# EasyEDA schematic TRS-80 Testboard.json
TITLE: Testboard; REV: 1.0; Date: 2022-04-18; Sheet: 1/1; Drawn By: dannybloe; Company: Your Company
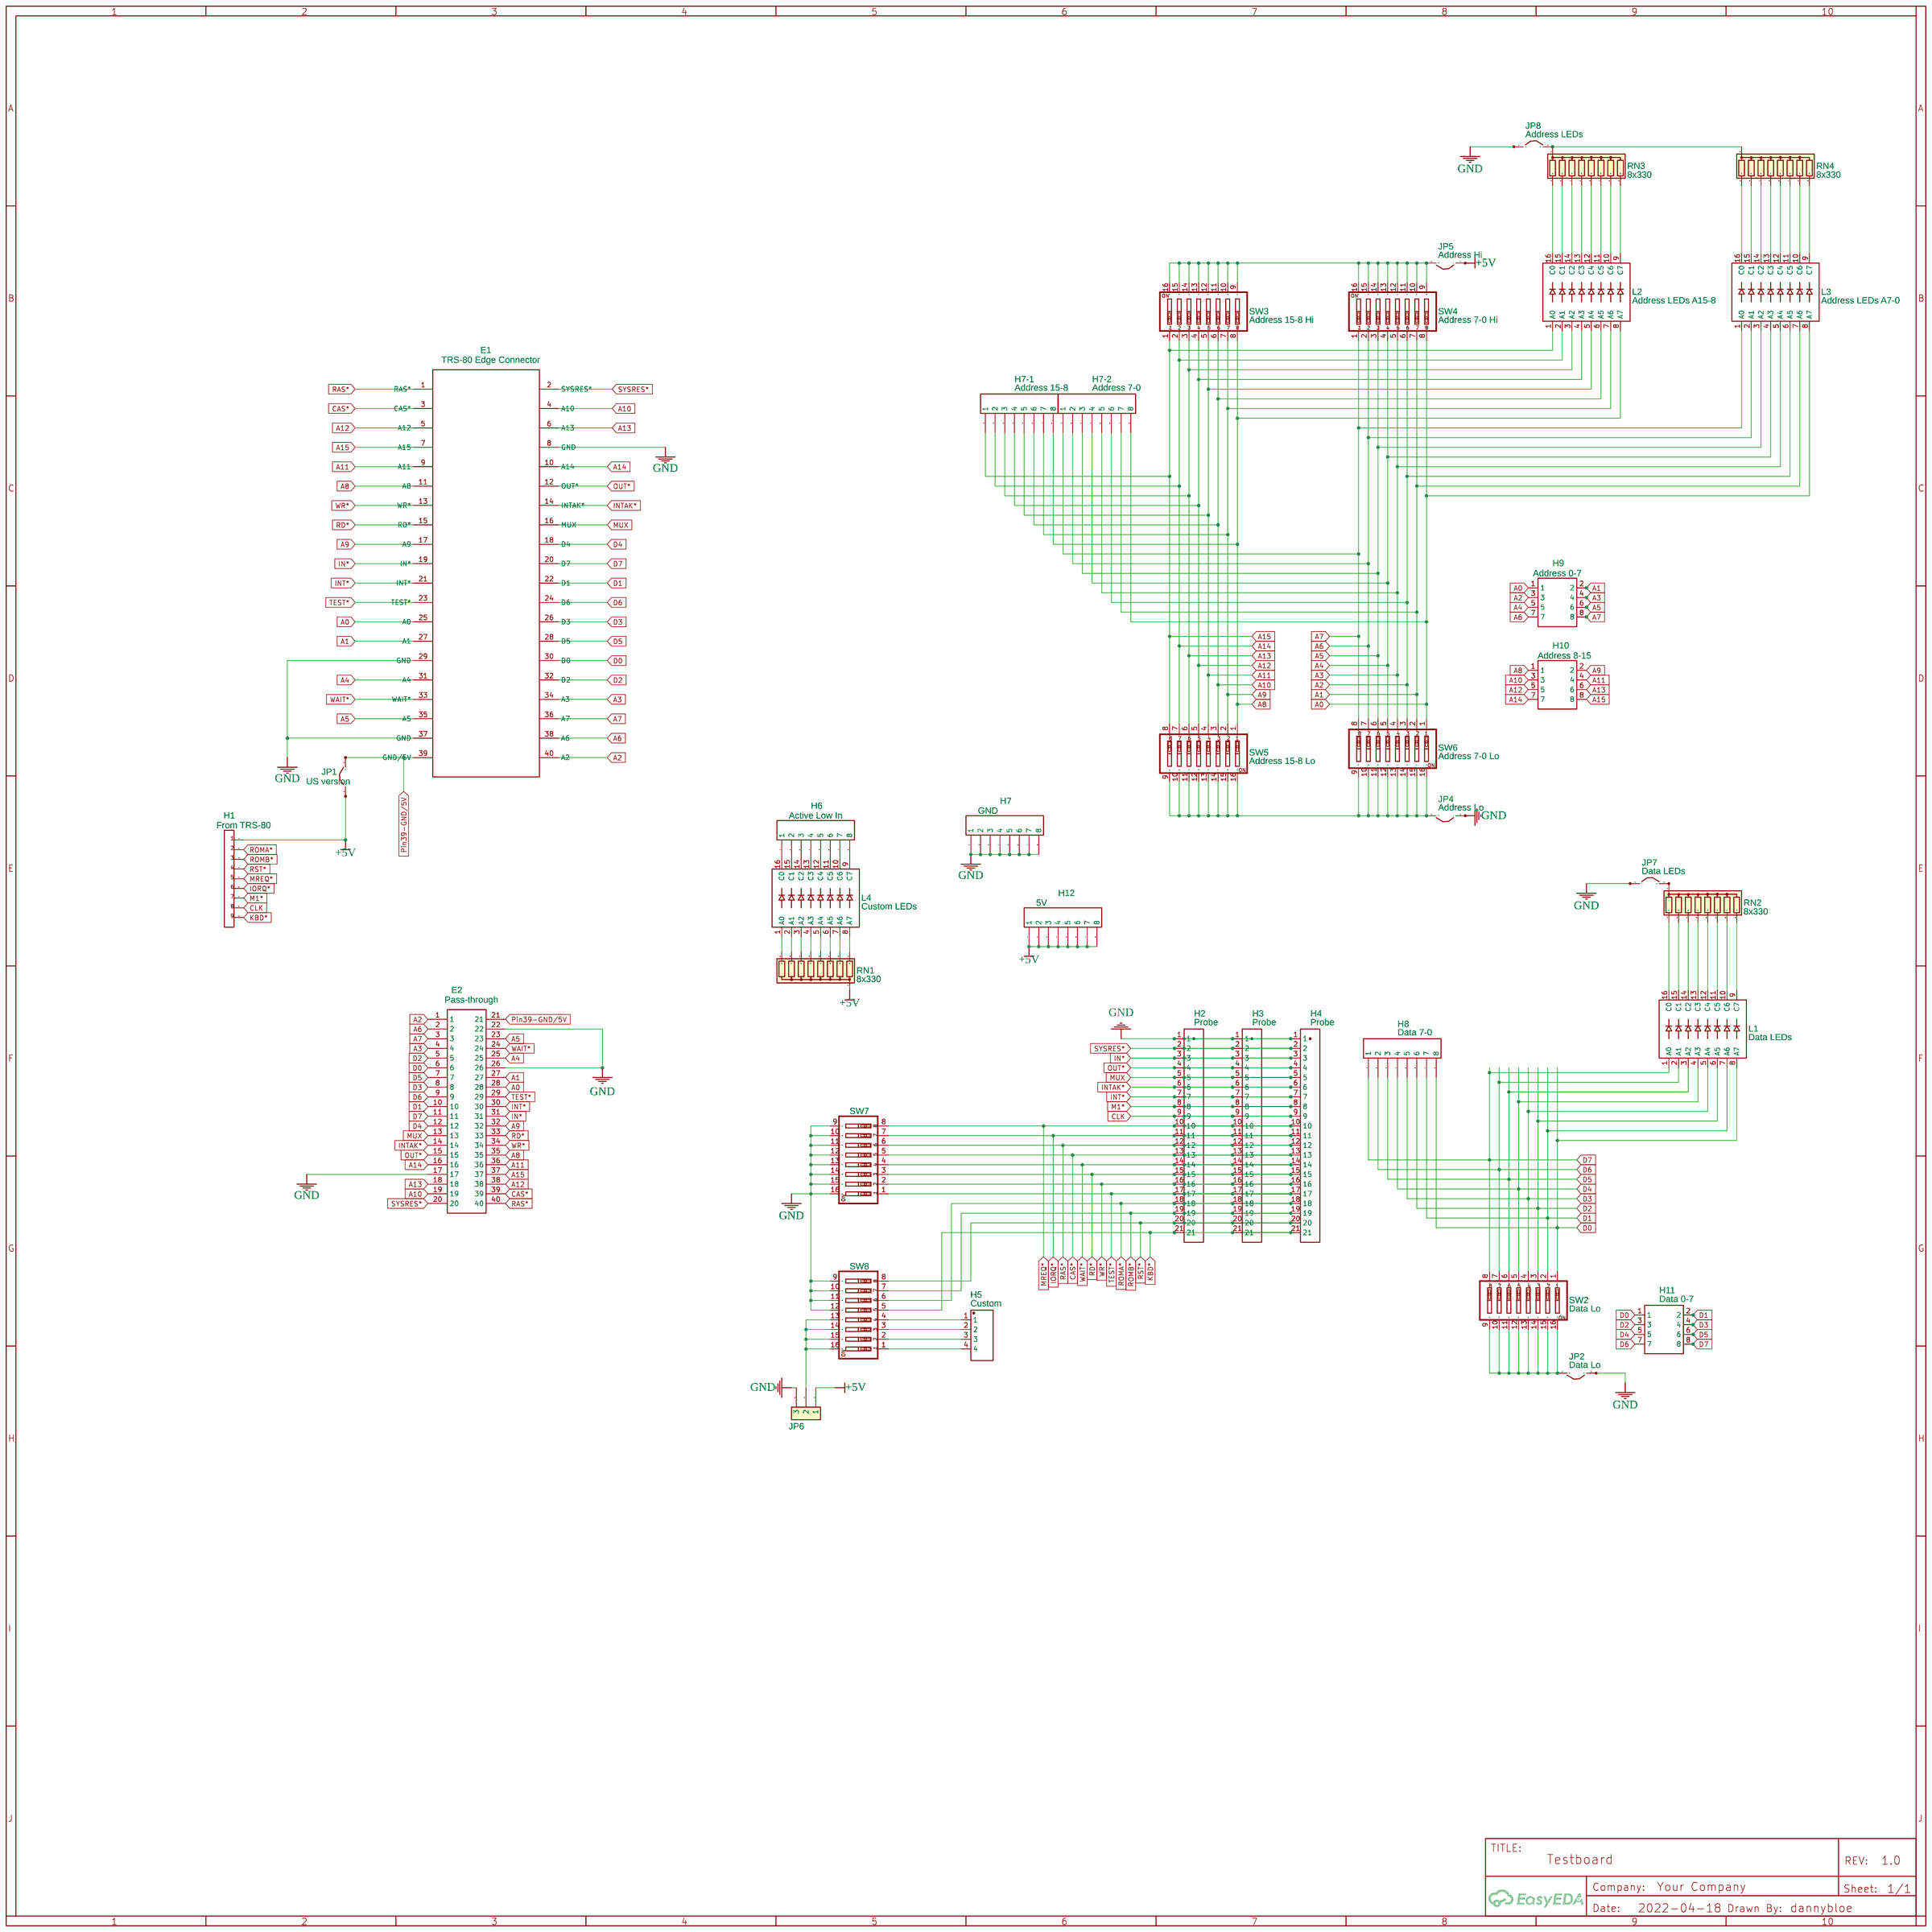
[diagram p0: schematic sheet]

## Parts
E1  TRS-80 Edge Connector  [TRS-80 EDGE CONNECTOR FOOTPRINT]
E2  Pass-through  [40-POS EDGE CONNECTOR]
H1  From TRS-80  [HEADER1X9_2.54]
H2  Probe  [21P]
H3  Probe  [21P]
H4  Probe  [21P]
H5  Custom  [HEADER - HEADER-FEMALE-2.54_1X4]
H6  Active Low In  [HDR-TH_8PIN-V-MALE-PITCH2.54]
H7  GND  [HDR-TH_8PIN-V-MALE-PITCH2.54]
H7-1  Address 15-8  [HDR-TH_8PIN-V-MALE-PITCH2.54]
H7-2  Address 7-0  [HDR-TH_8PIN-V-MALE-PITCH2.54]
H8  Data 7-0  [HDR-TH_8PIN-V-MALE-PITCH2.54]
H9  Address 0-7  [BOX HEADER 8P]
H10  Address 8-15  [BOX HEADER 8P]
H11  Data 0-7  [BOX HEADER 8P]
H12  5V  [HDR-TH_8PIN-V-MALE-PITCH2.54]
JP1  US version  [HDR-TH_2P-P2.54-V-M-1]
JP2  Data Lo  [HDR-TH_2P-P2.54-V-M-1]
JP4  Address Lo  [HDR-TH_2P-P2.54-V-M-1]
JP5  Address Hi  [HDR-TH_2P-P2.54-V-M-1]
JP6  Header1x3  [HEADER1X3]
JP7  Data LEDs  [HDR-TH_2P-P2.54-V-M-1]
JP8  Address LEDs  [HDR-TH_2P-P2.54-V-M-1]
L1  Data LEDs  [BARGRAPH_8]
L2  Address LEDs A15-8  [BARGRAPH_8]
L3  Address LEDs A7-0  [BARGRAPH_8]
L4  Custom LEDs  [BARGRAPH_8]
RN1  8x330  [RESISTORNETWORK_8]
RN2  8x330  [RESISTORNETWORK_8]
RN3  8x330  [RESISTORNETWORK_8]
RN4  8x330  [RESISTORNETWORK_8]
SW2  Data Lo  [DIPSWITCH-08]
SW3  Address 15-8 Hi  [DIPSWITCH-08]
SW4  Address 7-0 Hi  [DIPSWITCH-08]
SW5  Address 15-8 Lo  [DIPSWITCH-08]
SW6  Address 7-0 Lo  [DIPSWITCH-08]
SW7  Switches  [DIPSWITCH-08]
SW8  Switches  [DIPSWITCH-08]

## Library data of the parts
E1 = TRS-80 Edge Connector: Contributor: Guest
E2 = 40-pos Edge Connector: Contributor: jowbiwan
H1 = Header1x9_2.54: Contributor: yabb777
H2-H4 = Header 21pin: Contributor: dannybloe
H5 = HEADER - HEADER-FEMALE-2.54_1X4: Contributor: chrisrisse; Supplier: Sparkfun
H6 H7 H7-1 H7-2 H8 H12 = Header2.54mm 1*8P: Supplier Part: C49256; Supplier: LCSC; Manufacturer: ReliaPro; image: http://image.lceda.cn/szlcsc/C49256.jpg; Contributor: ishtiaq1ahmed
H9-H11 = Box Header 8P: Manufacturer Part: BKL 10120552; Contributor: woodencup
JP1 JP2 JP4 JP5 JP7 JP8 = JUMPERTHRUHOLE: Supplier Part: NONE; Manufacturer: NONE; Manufacturer Part: NONE; Contributor: RaspAutomacao
JP6 = Header1x3: Supplier Part: C35445; Supplier: LCSC; Manufacturer: LCSC; Manufacturer Part: Header-Female-2.54_1x10; Contributor: Createyourpersonalaccount
L1-L4 = BARGRAPH_8: Contributor: Serotonindude
RN1-RN4 = Resistor Network 8: Contributor: Serotonindude; license: https://www.gnu.org/licenses/lgpl-2.1.html
SW2-SW8 = SW_DIP-8: Contributor: Umair Khan

## Nets
+5V: H1.1 H12.1 H12.2 H12.3 H12.4 H12.5 H12.6 H12.7 H12.8 JP1.1 JP5.1 JP6.1 RN1.1(common)
GND: E1.8(GND) E1.29(GND) E1.37(GND) E2.17 E2.22 E2.26 H2.1 H3.1 H4.1 H7.1 H7.2 H7.3 H7.4 H7.5 H7.6 H7.7 H7.8 JP2.1 JP4.1 JP6.3 JP7.1 JP8.1 SW7.9 SW7.10 SW7.11 SW7.12 SW7.13 SW7.14 SW7.15 SW7.16 SW8.9 SW8.10 SW8.11 SW8.12
Pin39-GND/5V: E1.39(GND/5V) E2.21 JP1.2
A0: E1.25(A0) E2.28 H7-2.8 H9.1 L3.8(A7) SW4.8 SW6.1
A1: E1.27(A1) E2.27 H7-2.7 H9.2 L3.7(A6) SW4.7 SW6.2
A2: E1.40(A2) E2.1 H7-2.6 H9.3 L3.6(A5) SW4.6 SW6.3
A3: E1.34(A3) E2.4 H7-2.5 H9.4 L3.5(A4) SW4.5 SW6.4
A4: E1.31(A4) E2.25 H7-2.4 H9.5 L3.4(A3) SW4.4 SW6.5
A5: E1.35(A5) E2.23 H7-2.3 H9.6 L3.3(A2) SW4.3 SW6.6
A6: E1.38(A6) E2.2 H7-2.2 H9.7 L3.2(A1) SW4.2 SW6.7
A7: E1.36(A7) E2.3 H7-2.1 H9.8 L3.1(A0) SW4.1 SW6.8
A8: E1.11(A8) E2.35 H7-1.8 H10.1 L2.8(A7) SW3.8 SW5.1
A9: E1.17(A9) E2.32 H7-1.7 H10.2 L2.7(A6) SW3.7 SW5.2
A10: E1.4(A10) E2.19 H7-1.6 H10.3 L2.6(A5) SW3.6 SW5.3
A11: E1.9(A11) E2.36 H7-1.5 H10.4 L2.5(A4) SW3.5 SW5.4
A12: E1.5(A12) E2.38 H7-1.4 H10.5 L2.4(A3) SW3.4 SW5.5
A13: E1.6(A13) E2.18 H7-1.3 H10.6 L2.3(A2) SW3.3 SW5.6
A14: E1.10(A14) E2.16 H7-1.2 H10.7 L2.2(A1) SW3.2 SW5.7
A15: E1.7(A15) E2.37 H7-1.1 H10.8 L2.1(A0) SW3.1 SW5.8
CAS*: E1.3(CAS*) E2.39 H2.13 H3.13 H4.13 SW7.5
CLK: H1.8 H2.9 H3.9 H4.9
D0: E1.30(D0) E2.6 H8.8 H11.1 L1.8(A7) SW2.1
D1: E1.22(D1) E2.10 H8.7 H11.2 L1.7(A6) SW2.2
D2: E1.32(D2) E2.5 H8.6 H11.3 L1.6(A5) SW2.3
D3: E1.26(D3) E2.8 H8.5 H11.4 L1.5(A4) SW2.4
D4: E1.18(D4) E2.12 H8.4 H11.5 L1.4(A3) SW2.5
D5: E1.28(D5) E2.7 H8.3 H11.6 L1.3(A2) SW2.6
D6: E1.24(D6) E2.9 H8.2 H11.7 L1.2(A1) SW2.7
D7: E1.20(D7) E2.11 H8.1 H11.8 L1.1(A0) SW2.8
IN*: E1.19(IN*) E2.31 H2.3 H3.3 H4.3
INT*: E1.21(INT*) E2.30 H2.7 H3.7 H4.7
INTAK*: E1.14(INTAK*) E2.14 H2.6 H3.6 H4.6
IORQ*: H1.6 H2.11 H3.11 H4.11 SW7.7
KBD*: H1.9 H2.21 H3.21 H4.21 SW8.5
M1*: H1.7 H2.8 H3.8 H4.8
MREQ*: H1.5 H2.10 H3.10 H4.10 SW7.8
MUX: E1.16(MUX) E2.13 H2.5 H3.5 H4.5
OUT*: E1.12(OUT*) E2.15 H2.4 H3.4 H4.4
RAS*: E1.1(RAS*) E2.40 H2.12 H3.12 H4.12 SW7.6
RD*: E1.15(RD*) E2.33 H2.15 H3.15 H4.15 SW7.3
ROMA*: H1.2 H2.18 H3.18 H4.18 SW8.6
ROMB*: H1.3 H2.19 H3.19 H4.19 SW8.7
RST*: H1.4 H2.20 H3.20 H4.20 SW8.8
SYSRES*: E1.2(SYSRES*) E2.20 H2.2 H3.2 H4.2
TEST*: E1.23(TEST*) E2.29 H2.17 H3.17 H4.17 SW7.1
WAIT*: E1.33(WAIT*) E2.24 H2.14 H3.14 H4.14 SW7.4
WR*: E1.13(WR*) E2.34 H2.16 H3.16 H4.16 SW7.2
Net-(H5-1): H5.1 SW8.4
Net-(H5-2): H5.2 SW8.3
Net-(H5-3): H5.3 SW8.2
Net-(H5-4): H5.4 SW8.1
Net-(H6-1): H6.1 L4.16(C0)
Net-(H6-2): H6.2 L4.15(C1)
Net-(H6-3): H6.3 L4.14(C2)
Net-(H6-4): H6.4 L4.13(C3)
Net-(H6-5): H6.5 L4.12(C4)
Net-(H6-6): H6.6 L4.11(C5)
Net-(H6-7): H6.7 L4.10(C6)
Net-(H6-8): H6.8 L4.9(C7)
Net-(JP2-2): JP2.2 SW2.9 SW2.10 SW2.11 SW2.12 SW2.13 SW2.14 SW2.15 SW2.16
Net-(JP4-2): JP4.2 SW5.9 SW5.10 SW5.11 SW5.12 SW5.13 SW5.14 SW5.15 SW5.16 SW6.9 SW6.10 SW6.11 SW6.12 SW6.13 SW6.14 SW6.15 SW6.16
Net-(JP5-2): JP5.2 SW3.9 SW3.10 SW3.11 SW3.12 SW3.13 SW3.14 SW3.15 SW3.16 SW4.9 SW4.10 SW4.11 SW4.12 SW4.13 SW4.14 SW4.15 SW4.16
Net-(JP6-2): JP6.2 SW8.13 SW8.14 SW8.15 SW8.16
Net-(JP7-2): JP7.2 RN2.1(common)
Net-(JP8-2): JP8.2 RN3.1(common) RN4.1(common)
Net-(L1-9): L1.9(C7) RN2.9(R8)
Net-(L1-10): L1.10(C6) RN2.8(R7)
Net-(L1-11): L1.11(C5) RN2.7(R6)
Net-(L1-12): L1.12(C4) RN2.6(R5)
Net-(L1-13): L1.13(C3) RN2.5(R4)
Net-(L1-14): L1.14(C2) RN2.4(R3)
Net-(L1-15): L1.15(C1) RN2.3(R2)
Net-(L1-16): L1.16(C0) RN2.2(R1)
Net-(L2-9): L2.9(C7) RN3.9(R8)
Net-(L2-10): L2.10(C6) RN3.8(R7)
Net-(L2-11): L2.11(C5) RN3.7(R6)
Net-(L2-12): L2.12(C4) RN3.6(R5)
Net-(L2-13): L2.13(C3) RN3.5(R4)
Net-(L2-14): L2.14(C2) RN3.4(R3)
Net-(L2-15): L2.15(C1) RN3.3(R2)
Net-(L2-16): L2.16(C0) RN3.2(R1)
Net-(L3-9): L3.9(C7) RN4.9(R8)
Net-(L3-10): L3.10(C6) RN4.8(R7)
Net-(L3-11): L3.11(C5) RN4.7(R6)
Net-(L3-12): L3.12(C4) RN4.6(R5)
Net-(L3-13): L3.13(C3) RN4.5(R4)
Net-(L3-14): L3.14(C2) RN4.4(R3)
Net-(L3-15): L3.15(C1) RN4.3(R2)
Net-(L3-16): L3.16(C0) RN4.2(R1)
Net-(L4-1): L4.1(A0) RN1.9(R8)
Net-(L4-2): L4.2(A1) RN1.8(R7)
Net-(L4-3): L4.3(A2) RN1.7(R6)
Net-(L4-4): L4.4(A3) RN1.6(R5)
Net-(L4-5): L4.5(A4) RN1.5(R4)
Net-(L4-6): L4.6(A5) RN1.4(R3)
Net-(L4-7): L4.7(A6) RN1.3(R2)
Net-(L4-8): L4.8(A7) RN1.2(R1)
